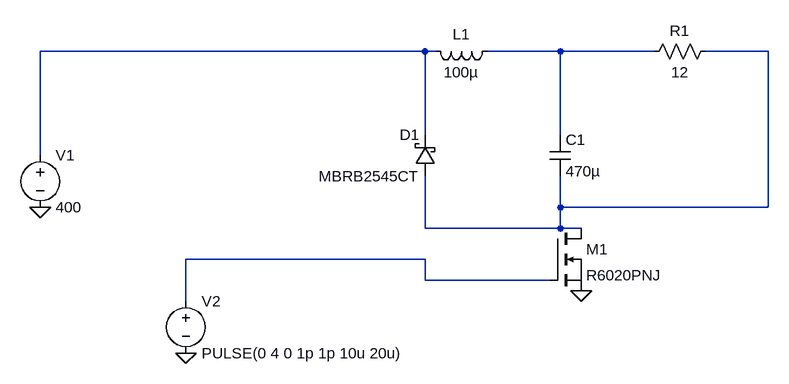
[diagram p0: schematic Draft2.asc]
Draft2.asc, the LTspice schematic file:
Version 4
SHEET 1 880 680
WIRE 176 128 -416 128
WIRE 192 128 176 128
WIRE 384 128 272 128
WIRE 528 128 384 128
WIRE 704 128 608 128
WIRE 176 256 176 128
WIRE 384 256 384 128
WIRE -416 288 -416 128
WIRE 384 368 384 320
WIRE 704 368 704 128
WIRE 704 368 384 368
WIRE 176 400 176 320
WIRE 384 400 384 368
WIRE 384 400 176 400
WIRE 416 400 384 400
WIRE 176 448 -192 448
WIRE 176 480 176 448
WIRE 368 480 176 480
WIRE -192 512 -192 448
FLAG -416 368 0
FLAG 416 496 0
FLAG -192 592 0
SYMBOL nmos 368 400 R0
SYMATTR InstName M1
SYMATTR Value R6020PNJ
SYMBOL ind 288 112 R90
WINDOW 0 5 56 VBottom 2
WINDOW 3 32 56 VTop 2
SYMATTR InstName L1
SYMATTR Value 100µ
SYMBOL schottky 192 320 R180
WINDOW 0 24 64 Left 2
WINDOW 3 24 0 Left 2
SYMATTR InstName D1
SYMATTR Value MBRB2545CT
SYMATTR Description Diode
SYMATTR Type diode
SYMBOL cap 368 256 R0
SYMATTR InstName C1
SYMATTR Value 470µ
SYMBOL res 624 112 R90
WINDOW 0 0 56 VBottom 2
WINDOW 3 32 56 VTop 2
SYMATTR InstName R1
SYMATTR Value 12
SYMBOL voltage -416 272 R0
SYMATTR InstName V1
SYMATTR Value 400
SYMBOL voltage -192 496 R0
WINDOW 123 0 0 Left 0
WINDOW 39 0 0 Left 0
SYMATTR InstName V2
SYMATTR Value PULSE(0 4 0 1p 1p 10u 20u)

The netlist it stands for:
* Draft2.asc
M1 N003 N004 0 0 R6020PNJ
L1 N002 N001 100µ
D1 N003 N001 MBRB2545CT
C1 N002 N003 470µ
R1 N003 N002 12
V1 N001 0 400
V2 N004 0 PULSE(0 4 0 1p 1p 10u 20u)
.model D D
.lib standard.dio
.model NMOS NMOS
.model PMOS PMOS
.lib standard.mos
.backanno
.end